# EAGLE board touch_board (EAGLE 6.6.0)
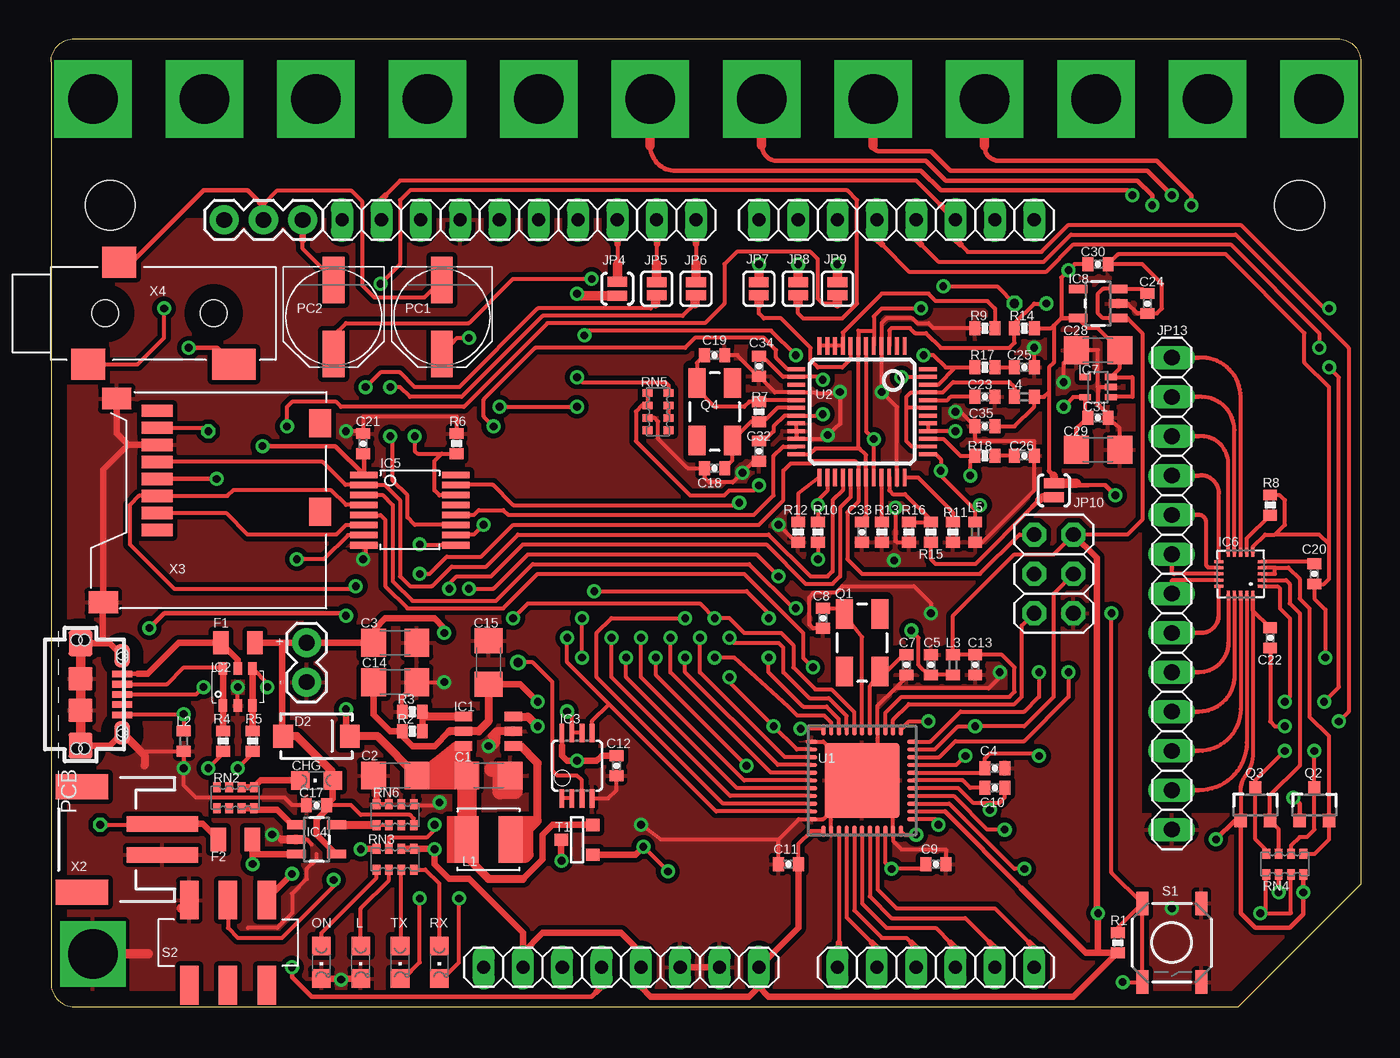
[diagram p2: board, top side]
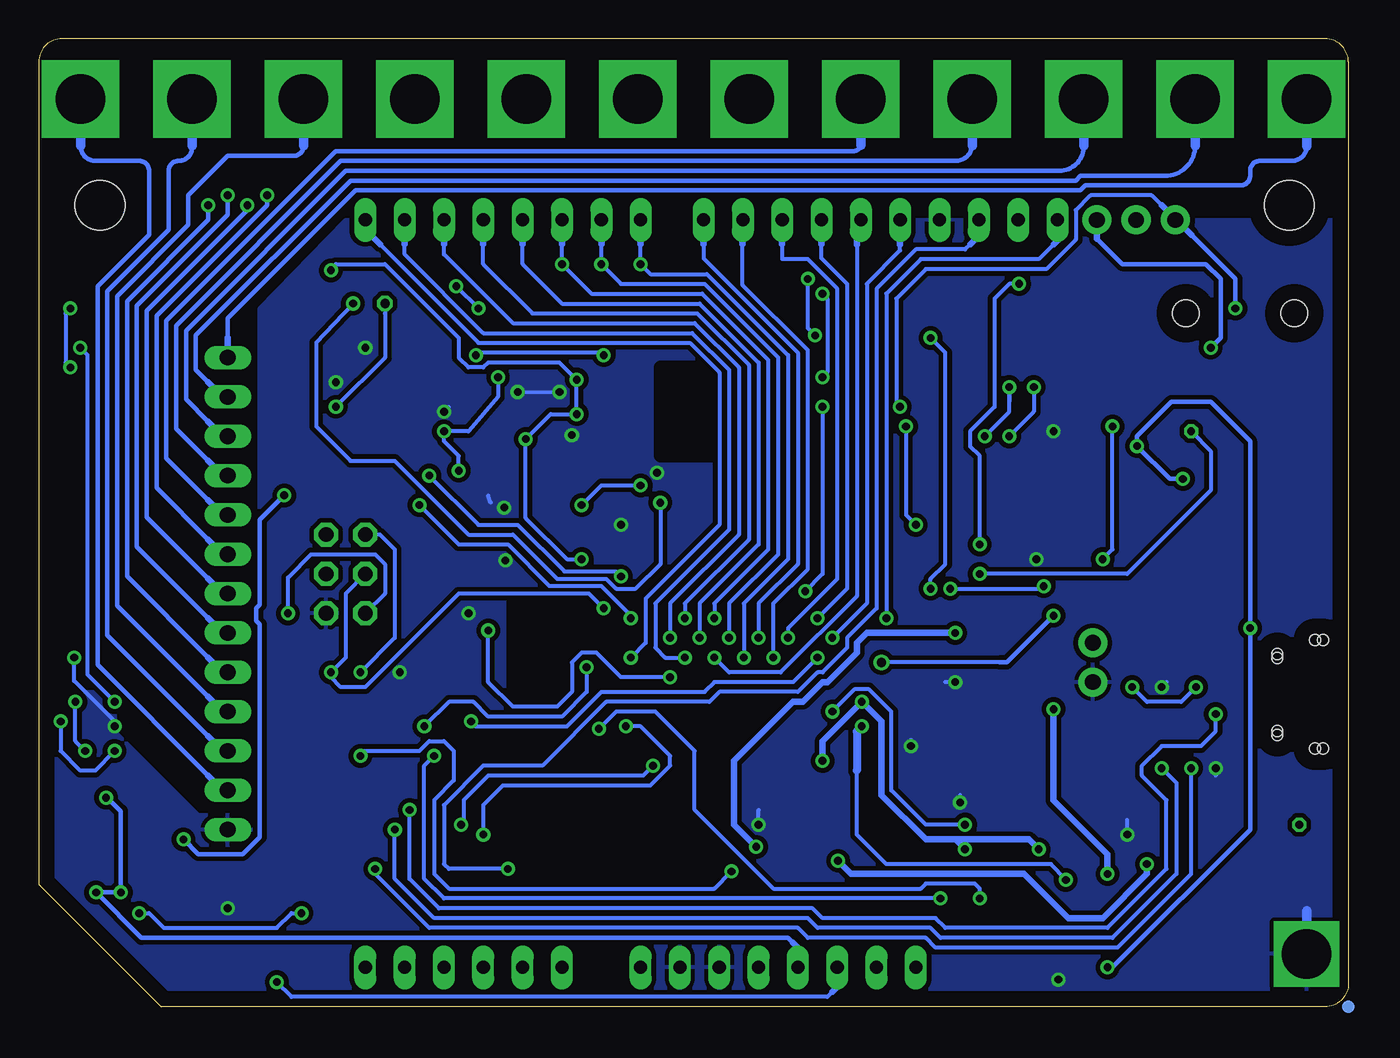
[diagram p3: board, bottom side, seen from below]

Size 84.6 x 62.5 mm. Coordinates in mm from the lower left corner, seen from the top.
Outline: 0,61 0,1.5 arc90 1.5,0 76.7,0 84.6,7.9 84.6,61 arc90 83.1,62.5 1.5,62.5 arc90 0,61
Copper layers (1*16): Top 0.035mm / dielectric 1.5mm / Bottom 0.035mm
Design rules "default *": minimum track width 10mil, minimum drill 20mil, track to track 8mil, track to pad 8mil, pad to pad 8mil, via to via 8mil, smd to smd 8mil, copper to edge 40mil, drill to drill 8mil, minimum pad ring 10mil, minimum via ring 8mil, stop-mask expansion 1.25mil, vias tented up to drill 0mil, thermal gap 10mil
Net classes: 1 power: width 0.254 mm, drill 0.61 mm, clearance 0.254 mm; 2 gnd: width 0.254 mm, drill 0.61 mm, clearance 0.254 mm; 3 usbvcc: width 0.254 mm, drill 0.61 mm, clearance 0.254 mm; 4 aref: width 0.254 mm, drill 0.61 mm, clearance 0.254 mm
Holes 3.2 mm at 80.64,51.75 3.81,51.75
tRestrict: area 41.3,35.6 to 44.5,41.3; area 50.8,20.6 to 54,26.4; area 27.6,9.4 to 28.9,12.2
bRestrict: area 41.3,35.6 to 44.5,41.3; area 50.8,20.6 to 54,26.4

## Footprints (pad centres in the part's own frame; a part is rotated, then mirrored left to right if it is on the bottom)
1206 = smd 1.6 x 1.8: 1 -1.4,0; 2 1.4,0
0402-CAP = smd 0.7 x 0.9: 1 -0.65,0; 2 0.65,0
CHIPLED_0805 = smd 1.2 x 1.2: A 0,-1.05; C 0,1.05
SMA-DIODE = smd 1.27 x 1.47: A -2.15,0; C 2.15,0
0805 = smd 1 x 1.5: 1 -1.1,0; 2 1.1,0
6-LEAD-SOT23 = smd 0.6 x 1.1: 1 -0.95,-1.6; 2 0,-1.6; 3 0.95,-1.6; 4 0.95,1.6; 5 0,1.6; 6 -0.95,1.6
SOT457 = smd 0.8 x 0.55: 1 -1.2,0.95; 2 -1.2,0; 3 -1.2,-0.95; 4 1.2,-0.95; 5 1.2,0; 6 1.2,0.95
MSOP08 = smd 0.3 x 1.2: 1 -0.976,-2.113; 2 -0.326,-2.113; 3 0.324,-2.113; 4 0.974,-2.113; 5 0.974,2.112; 6 0.324,2.112; 7 -0.326,2.112; 8 -0.976,2.112
SOT23-5 = smd 0.55 x 1.2: 1 -0.95,-1.3; 2 0,-1.3; 3 0.95,-1.3; 4 0.95,1.3; 5 -0.95,1.3
TSSOP-16 = smd 0.42 x 1.78: 1 -2.275,-2.97; 2 -1.625,-2.97; 3 -0.975,-2.97; 4 -0.325,-2.97; 5 0.325,-2.97; 6 0.975,-2.97; 7 1.625,-2.97; 8 2.275,-2.97; 9 2.275,2.97; 10 1.625,2.97; 11 0.975,2.97; 12 0.325,2.97; 13 -0.325,2.97; 14 -0.975,2.97; 15 -1.625,2.97; 16 -2.275,2.97
QFN-20-0.4MM = smd 0.6 x 0.2: 1 -1.4,0.8; 2 -1.4,0.4; 3 -1.4,0; 4 -1.4,-0.4; 5 -1.4,-0.8; 11 1.4,-0.8; 12 1.4,-0.4; 13 1.4,0; 14 1.4,0.4; 15 1.4,0.8 | smd 0.2 x 0.6: 6 -0.8,-1.4; 7 -0.4,-1.4; 8 0,-1.4; 9 0.4,-1.4; 10 0.8,-1.4; 16 0.8,1.4; 17 0.4,1.4; 18 0,1.4; 19 -0.4,1.4; 20 -0.8,1.4
SC70 = smd 0.4 x 0.75: 1 -0.65,-0.825; 2 0,-0.825; 3 0.65,-0.825; 4 0.65,0.825; 5 -0.65,0.825
2X03 = drill 0.95 pad 1.55 octagon: 1 -2.54,-1.27; 2 -2.54,1.27; 3 0,-1.27; 4 0,1.27; 5 2.54,-1.27; 6 2.54,1.27
1X08 = drill 0.85 pad 1.422 long: 1 -8.89,0; 2 -6.35,0; 3 -3.81,0; 4 -1.27,0; 5 1.27,0; 6 3.81,0; 7 6.35,0; 8 8.89,0
1X06 = drill 0.85 pad 1.422 long: 1 -6.35,0; 2 -3.81,0; 3 -1.27,0; 4 1.27,0; 5 3.81,0; 6 6.35,0
1X02 = drill 1.016 pad 1.88: 1 0,0; 2 2.54,0
1X10 = drill 0.85 pad 1.422 long: 1 -11.43,0; 2 -8.89,0; 3 -6.35,0; 4 -3.81,0; 5 -1.27,0; 6 1.27,0; 7 3.81,0; 8 6.35,0; 9 8.89,0; 10 11.43,0
SJ_2S-NO = smd 0.635 x 1.27: 1 -0.45,0; 2 0.45,0
SJ_2S = smd 0.635 x 1.27: 1 -0.412,0; 2 0.412,0
1X03 = drill 1.016 pad 1.88: 1 0,0; 2 2.54,0; 3 5.08,0
1X13 = drill 1.016 long: 1 -15.24,0; 2 -12.7,0; 3 -10.16,0; 4 -7.62,0; 5 -5.08,0; 6 -2.54,0; 7 0,0; 8 2.54,0; 9 5.08,0; 10 7.62,0; 11 10.16,0; 12 12.7,0; 13 15.24,0
LQH44PN100MP0L = smd 1.55 x 3: 1 -1.425,0; 2 1.425,0
0402 = smd 0.7 x 0.9: 1 -0.65,0; 2 0.65,0
TP-SP = smd 0.8 x 0.8 bottom: X 0,0
PANASONIC_D = smd 3 x 1.4: + 2.4,0; - -2.4,0
CRYSTAL-SMD-5X3 = smd 1.9 x 1.1: 1 -1.85,-1.15; 2 1.85,-1.15; 3 1.85,1.15; 4 -1.85,1.15
SOT23-3 = smd 0.8 x 0.9: 1 -0.95,-1; 2 0.95,-1; 3 0,1.1
0402-RES = smd 0.7 x 0.9: 1 -0.65,0; 2 0.65,0
CAY16 = smd 0.5 x 0.65: 1 -1.2,-0.675; 2 -0.4,-0.675; 3 0.4,-0.675; 4 1.2,-0.675; 5 1.2,0.675; 6 0.4,0.675; 7 -0.4,0.675; 8 -1.2,0.675
TACTILE_SWITCH_SMD@1 = smd 1.524 x 0.762: 1 -2.54,1.905; 2 2.54,1.905; 3 -2.54,-1.905; 4 2.54,-1.905
JS202011SCQN = smd 1.2 x 2.5: 1 -2.5,-2.75; 2 0,-2.75; 3 2.5,-2.75; 4 -2.5,2.75; 5 0,2.75; 6 2.5,2.75
SOT-23 = smd 0.787 x 0.889: 1 0.025,-1.016; 2 -0.94,1.016; 3 0.991,1.016
QFN44ML7X7 = smd 0.75 x 0.275: 1 -3.275,2.5; 2 -3.275,2; 3 -3.275,1.5; 4 -3.275,1; 5 -3.275,0.5; 6 -3.275,0; 7 -3.275,-0.5; 8 -3.275,-1; 9 -3.275,-1.5; 10 -3.275,-2; 11 -3.275,-2.5; 23 3.275,-2.5; 24 3.275,-2; 25 3.275,-1.5; 26 3.275,-1; 27 3.275,-0.5; 28 3.275,0; 29 3.275,0.5; 30 3.275,1; 31 3.275,1.5; 32 3.275,2; 33 3.275,2.5 | smd 0.275 x 0.75: 12 -2.5,-3.275; 13 -2,-3.275; 14 -1.5,-3.275; 15 -1,-3.275; 16 -0.5,-3.275; 17 0,-3.275; 18 0.5,-3.275; 19 1,-3.275; 20 1.5,-3.275; 21 2,-3.275; 22 2.5,-3.275; 34 2.5,3.275; 35 2,3.275; 36 1.5,3.275; 37 1,3.275; 38 0.5,3.275; 39 0,3.275; 40 -0.5,3.275; 41 -1,3.275; 42 -1.5,3.275; 43 -2,3.275; 44 -2.5,3.275 | smd 4.826 x 4.826: EXP 0,0
LQFP-48 = smd 0.254 x 1.143: 1 -2.75,-4.25; 2 -2.25,-4.25; 3 -1.75,-4.25; 4 -1.25,-4.25; 5 -0.75,-4.25; 6 -0.25,-4.25; 7 0.25,-4.25; 8 0.75,-4.25; 9 1.25,-4.25; 10 1.75,-4.25; 11 2.25,-4.25; 12 2.75,-4.25; 25 2.75,4.25; 26 2.25,4.25; 27 1.75,4.25; 28 1.25,4.25; 29 0.75,4.25; 30 0.25,4.25; 31 -0.25,4.25; 32 -0.75,4.25; 33 -1.25,4.25; 34 -1.75,4.25; 35 -2.25,4.25; 36 -2.75,4.25 | smd 1.143 x 0.254: 13 4.25,-2.75; 14 4.25,-2.25; 15 4.25,-1.75; 16 4.25,-1.25; 17 4.25,-0.75; 18 4.25,-0.25; 19 4.25,0.25; 20 4.25,0.75; 21 4.25,1.25; 22 4.25,1.75; 23 4.25,2.25; 24 4.25,2.75; 37 -4.25,2.75; 38 -4.25,2.25; 39 -4.25,1.75; 40 -4.25,1.25; 41 -4.25,0.75; 42 -4.25,0.25; 43 -4.25,-0.25; 44 -4.25,-0.75; 45 -4.25,-1.25; 46 -4.25,-1.75; 47 -4.25,-2.25; 48 -4.25,-2.75
EDGE-ELEC-LEFT = drill 3.2 pad 5 square: 1 0,0
EDGE-ELEC-RIGHT = drill 3.2 pad 5 square: 1 0,0
EDGE-GND = drill 3.2 pad 4 square: P$1 0,0
EDGE-ELEC = drill 3.2 pad 5 square: 1 0,0
CON2_USB_MICRO_B_AT = smd 0.406 x 1.346: P1 -1.321,2.692; P2 -0.66,2.692; P3 0,2.692; P4 0.66,2.692; P5 1.321,2.692 | smd 1.651 x 1.549: S1 -3.302,0; S2 3.302,0 | smd 1.524 x 1.016: S3 -2.489,2.692; S4 2.489,2.692 | smd 1.524 x 1.524: S5 -1.016,0; S6 1.016,0 | hole 0.7: -3.505,0.254; -3.505,-0.254; 3.505,0.254; 3.505,-0.254; -2.616,2.692; -2.362,2.692; 2.362,2.692; 2.616,2.692
JST-2-SMD = smd 1 x 4.6: 1 -1,-3.7; 2 1,-3.7 | smd 1.6 x 3.4: NC1 -3.4,1.5; NC2 3.4,1.5
MSDC-PP-02 = smd 0.8 x 2: 1 5.06,10.94; 2 6.16,10.94; 3 7.26,10.94; 4 8.36,10.94; 5 9.46,10.94; 6 10.56,10.94; 7 11.66,10.94; 8 12.76,10.94 | smd 1.8 x 1.4: CD1 6.25,0.4; CD2 11.95,0.4 | smd 1.4 x 1.9: S1 0.4,14.4; S2 13.55,13.54
3POLE-JACK = smd 2.2 x 2: 1 2.4,-3.3; 3 4.4,3.3 | smd 2.8 x 2: 2 11.8,-3.3 | hole 1.7: 3.5,0; 10.5,0

## Placement (x,y rotation side)
C1  10uF  [1206]  28.26,14.92 0 top
C2  10uF  [1206]  22.23,14.92 180 top
C3  10uF  [1206]  22.23,23.5 0 top
C4  0.1uF  [0402-CAP]  60.96,15.4 180 top
C5  1uF  [0402-CAP]  56.83,22.07 270 top
C7  22pF  [0402-CAP]  55.24,22.07 270 top
C8  22pF  [0402-CAP]  49.85,25.08 270 top
C9  0.1uF  [0402-CAP]  57.15,9.21 180 top
C10  1uF  [0402-CAP]  60.96,14.13 180 top
C11  0.1uF  [0402-CAP]  47.62,9.21 0 top
C12  0.1uF  [0402-CAP]  36.51,15.56 90 top
C13  0.1uF  [0402-CAP]  59.69,22.07 90 top
C14  10uF  [1206]  22.23,20.95 0 top
C15  10uF  [1206]  28.26,22.23 90 top
C17  1uF  [0402-CAP]  17.14,13.02 0 top
C18  22pF  [0402-CAP]  42.86,34.77 180 top
C19  22pF  [0402-CAP]  42.86,42.07 0 top
C20  0.1uF  [0402-CAP]  81.6,27.94 90 top
C21  0.1uF  [0402-CAP]  20.16,36.35 270 top
C22  0.1uF  [0402-CAP]  78.74,23.81 90 top
C23  1uF  [0402-CAP]  60.33,39.37 0 top
C24  1uF  [0402-CAP]  70.8,45.4 90 top
C25  0.01uF  [0402-CAP]  62.87,41.27 180 top
C26  0.01uF  [0402-CAP]  62.87,35.56 180 top
C28  10uF  [1206]  67.63,42.39 180 top
C29  10uF  [1206]  67.63,35.96 0 top
C30  0.1uF  [0402-CAP]  67.63,47.94 180 top
C31  0.1uF  [0402-CAP]  67.63,38.02 180 top
C32  0.1uF  [0402-CAP]  45.72,35.88 90 top
C33  0.1uF  [0402-CAP]  52.39,30.64 90 top
C34  0.1uF  [0402-CAP]  45.72,41.35 90 top
C35  0.1uF  [0402-CAP]  60.33,37.47 0 top
CHG  Yellow  [CHIPLED_0805]  17.14,14.61 90 top
D2  B340  [SMA-DIODE]  17.14,17.46 0 top
F1  500mA  [0805]  12.06,23.5 0 top
F2  1.1A  [0805]  11.91,10.79 0 top
IC1  MCP1640  [6-LEAD-SOT23]  28.26,17.78 90 top
IC2  ESD Diode  [SOT457]  12.06,20.64 90 top
IC3  LM358  [MSOP08]  33.97,15.56 0 top
IC4  MCP73831  [SOT23-5]  17.14,10.79 270 top
IC5  74HC4050  [TSSOP-16]  23.18,32.07 270 top
IC6  MPR121  [QFN-20-0.4MM]  76.83,27.94 180 top
IC7  1.8V  [SC70]  67.63,40.01 90 top
IC8  MIC5219  [SOT23-5]  67.63,45.4 90 top
ICSP  ICSP  [2X03]  64.77,27.94 270 top
J1  8x1F-H8.5  [1X08]  36.83,2.54 0 top
J2  6x1F-H8.5  [1X06]  57.15,2.54 0 top
J3  8x1F-H8.5  [1X08]  54.61,50.8 180 top
JP1  External  [1X02]  16.51,20.95 90 top
JP3  10x1F-H8.5  [1X10]  30.23,50.8 180 top
JP4  [SJ_2S-NO]  36.58,46.35 90 top
JP5  [SJ_2S]  39.12,46.35 90 top
JP6  [SJ_2S]  41.66,46.35 90 top
JP7  [SJ_2S]  45.72,46.35 90 top
JP8  [SJ_2S]  48.26,46.35 90 top
JP9  [SJ_2S]  50.8,46.35 90 top
JP10  [SJ_2S-NO]  64.77,33.34 90 top
JP11  External Speaker  [1X03]  11.18,50.8 0 top
JP13  Touch Electrodes  [1X13]  72.39,26.67 270 top
L  Red  [CHIPLED_0805]  20,2.86 180 top
L1  LQH44P  [LQH44PN100MP0L]  28.26,10.79 180 top
L2  Ferrite  [0402]  8.57,17.14 90 top
L3  [0402]  58.26,22.07 270 top
L4  Ferrite  [0402]  62.87,39.37 180 top
L5  Ferrite  [0402]  59.69,30.64 270 top
ON  Green  [CHIPLED_0805]  17.46,2.86 180 top
ORIGIN  TP_SP  [TP-SP]  0,0 0 top
PC1  220uF  [PANASONIC_D]  25.24,44.53 270 top
PC2  220uF  [PANASONIC_D]  18.26,44.53 270 top
Q1  16MHz  [CRYSTAL-SMD-5X3]  52.39,23.5 270 top
Q2  BSS138  [SOT23-3]  81.6,13.02 0 top
Q3  BSS138  [SOT23-3]  77.79,13.02 0 top
Q4  12.288MHz  [CRYSTAL-SMD-5X3]  42.86,38.42 270 top
R1  75k  [0402-RES]  68.9,4.13 90 top
R2  976K  [0402-RES]  23.34,17.78 180 top
R3  309K  [0402-RES]  23.34,19.05 180 top
R4  22R  [0402-RES]  11.11,17.14 270 top
R5  22R  [0402-RES]  13.02,17.14 270 top
R6  75k  [0402-RES]  26.19,36.35 90 top
R7  976k  [0402-RES]  45.72,38.42 90 top
R8  75k  [0402-RES]  78.74,32.38 90 top
R9  75k  [0402-RES]  60.33,43.81 180 top
R10  75k  [0402-RES]  48.26,30.64 270 top
R11  75k  [0402-RES]  58.26,30.64 270 top
R12  75k  [0402-RES]  49.53,30.64 90 top
R13  75k  [0402-RES]  53.66,30.64 270 top
R14  75k  [0402-RES]  62.87,43.81 180 top
R15  75k  [0402-RES]  55.4,30.64 270 top
R16  75k  [0402-RES]  56.83,30.64 90 top
R17  22R  [0402-RES]  60.33,41.27 0 top
R18  22R  [0402-RES]  60.33,35.56 0 top
RN2  1K  [CAY16]  11.91,13.49 180 top
RN3  1K  [CAY16]  22.23,9.53 180 top
RN4  1K  [CAY16]  79.69,9.21 180 top
RN5  10k  [CAY16]  39.21,38.42 270 top
RN6  10K  [CAY16]  22.23,12.38 0 top
RX  Yellow  [CHIPLED_0805]  25.08,2.86 180 top
S1  RESET  [TACTILE_SWITCH_SMD@1]  72.39,4.13 270 top
S2  DPDT  [JS202011SCQN]  11.43,4.13 0 top
T1  FDN340P  [SOT-23]  33.97,10.79 270 top
TX  Yellow  [CHIPLED_0805]  22.54,2.86 180 top
U1  ATMEGA32U4  [QFN44ML7X7]  52.39,14.61 180 top
U2  VS1053  [LQFP-48]  52.39,38.42 180 top
U$1  EDGE-ELEC-LEFT  [EDGE-ELEC-LEFT]  2.7,58.6 0 top
U$3  EDGE-ELEC-RIGHT  [EDGE-ELEC-RIGHT]  81.9,58.6 0 top
U$6  EDGE-GND  [EDGE-GND]  2.7,3.4 0 top
U$8  OSHW-LOGO  [OSHW-LOGO]  -3.02,-1.43 0 top  (outside the outline)
U$17  EDGE-ELEC  [EDGE-ELEC]  74.7,58.6 0 top
U$18  EDGE-ELEC  [EDGE-ELEC]  67.5,58.6 0 top
U$22  EDGE-ELEC  [EDGE-ELEC]  60.3,58.6 0 top
U$24  EDGE-ELEC  [EDGE-ELEC]  53.1,58.6 0 top
U$26  EDGE-ELEC  [EDGE-ELEC]  45.9,58.6 0 top
U$27  EDGE-ELEC  [EDGE-ELEC]  38.7,58.6 0 top
U$28  EDGE-ELEC  [EDGE-ELEC]  31.5,58.6 0 top
U$29  EDGE-ELEC  [EDGE-ELEC]  24.3,58.6 0 top
U$30  EDGE-ELEC  [EDGE-ELEC]  17.1,58.6 0 top
U$31  EDGE-ELEC  [EDGE-ELEC]  9.9,58.6 0 top
X1  USB MICRO  [CON2_USB_MICRO_B_AT]  1.91,20.16 270 top
X2  Batt  [JST-2-SMD]  3.49,10.79 90 top
X3  MICRO-SD  [MSDC-PP-02]  17.78,25.72 90 top
X4  [3POLE-JACK]  0,44.77 0 top

## Tracks (layer width: path | path; a pad name or v marks a point on that pad's centre or on a via)
1.8V  (via drill 0.5, 0.6)
  Top 0.254: C29.1 66.23,37.35 C31.2 66.8,38.27 IC7.5 66.03,39.35 v65.41,38.73 | U2.24 49,35.67 49.37,36.04 52.23,36.04 | C33.2 52.39,31.43 52.64,31.68 U2.31 52.64,35.63 52.23,36.04 | v56.2,45.09 53.66,45.09 53.14,44.56 U2.5 53.14,43.66 52.14,43.66 U2.7 52.14,36.13 52.23,36.04 | v57.63,46.51 61.12,46.51 v62.23,45.4
  Bottom 0.254: v57.63,46.51 v56.2,45.09 | v65.41,38.73 62.23,41.91 62.23,44.77 v62.23,45.4
3.3V  (via drill 0.5, 0.6)
  Top 0.254: RN4.8 80.96,8.46 | Q3.1 76.83,12.33 | 76.83,12.34 Q3.1 | C22.2 77.64,25.57 IC6.20 77.64,16.36 arc-37 77.15,14.92 arc42 76.83,13.81 76.83,12.34 | U2.6 52.64,37.15 v53.14,36.65 U2.32 | IC7.1 68.47,39.37 69.85,39.37 69.85,40.64 69.83,40.66 IC7.3 69.03,41.23 C28.1 69.03,42.41 67.63,43.81 66.97,43.81 IC8.5 | v49.85,38.26 49.85,38.17 U2.19 47.38,38.17 46.67,37.47 46.67,37.15 46.05,36.53 C32.2 | v49.85,40.48 49.85,40.67 U2.14 47.28,40.67 45.95,42 C34.2 | R12.1 v49.53,28.89 | 76.83,12.34 76.83,12.33 | 20.21,35.66 C21.2 | 65.25,44.45 | 65.25,44.45 IC8.5 | IC8.5 65.25,44.45 | 65.25,44.45 | JP10.2 64.9,33.66 | 64.77,43.97 65.25,44.45 | 65.25,44.45 65.25,47.07 v65.72,47.55 66.12,47.94 C30.2 | 64.77,43.97 64.77,41.59 64.45,41.27 64.45,39.69 | C35.2 62.23,37.47 63.52,38.75 L4.1 64.14,39.37 64.45,39.69 | 76.83,12.33 Q3.1 | R14.1 64.61,43.81 64.77,43.97 | 64.45,39.69 64.45,34.61 | 34.29,14.61 IC3.3 34.3,14.6 34.29,14.61 | 34.29,14.61 33.97,14.92 32.7,14.92 32.38,15.24 32.38,20.95 31.11,22.23 v30.16,22.23 | 68.1,33.66 66.99,33.66
  Top 0.305: X3.4 v10.69,34.08 | RN4.8 v80.89,7.37 80.89,5.96 80.01,5.08 77.79,5.08 76.83,6.03 Q3.1 | 20.21,35.66 IC5.1 18.36,36.2 v13.65,36.2 | Q2.1 80.65,13.09 v80.25,13.49 | Q3.1 76.47,12.02 v75.25,10.79 | 68.1,33.66 v68.74,33.02 | 35.56,1.27 34.92,0.64 16.83,0.64 15.56,1.91 v15.56,2.54 | RN4.6 v79.29,7.37 | 64.77,34.29 64.45,34.61 | 66.22,33.79 66.36,33.66 66.99,33.66 | v6.35,24.45 7.3,25.4 18.89,25.4 v19.05,25.24
  Top 0.406: 35.24,0.95 35.56,1.27 J1.4
  Top 0.508: 64.77,34.29 JP10.2
  Top 0.61: 66.22,33.79 JP10.2
  Bottom 0.254: v49.53,28.89 50.48,28.89 53.14,31.55 v53.14,36.65 51.53,38.26 v49.85,38.26 v49.85,40.48 50.96,41.59 55.56,41.59 55.88,41.27 56.83,41.27 57.47,41.91 57.47,43.18 62.23,47.94 65.41,47.94 65.72,47.62 v65.72,47.55 | 80.17,13.49 v80.25,13.49 | 22.54,22.23 v30.16,22.23
  Bottom 0.305: 35.88,4.13 36.2,4.45 77.97,4.45 v80.89,7.37 v79.29,7.37 79.29,12.62 80.17,13.49 | v10.69,34.08 11.54,34.08 v13.65,36.2 13.65,36.83 11.43,39.05 8.89,39.05 6.35,36.51 v6.35,24.45 6.35,11.43 15.24,2.54 v15.56,2.54 | v75.25,10.79 74.3,9.84 71.44,9.84 70.33,10.95 70.33,24.69 70.56,24.92 70.56,25.72 70.33,25.96 70.33,31.43 v68.74,33.02 | v19.05,25.24 22.07,22.23 22.54,22.23
  Bottom 0.406: 35.88,4.13 35.56,3.81 J1.4
5V  (via drill 0.5)
  Top 0.254: L3.1 58.1,22.54 | L3.1 58.26,25.24 62.23,29.21 64.77,29.21 ICSP.2 69.53,30.48 70.48,31.43 70.48,43.5 69.53,44.45 IC8.1 67.94,44.45 67.63,44.77 67.63,46.04 67.94,46.35 IC8.3 70.5,46.35 C24.2 | C13.2 L3.1 | 78.42,8.46 78.42,8.53 RN4.5 | RN4.5 arc90 78.42,8.46 | RN4.5 arc90 78.42,8.46 | 78.42,8.46 78.42,6.03 | 78.42,6.03 80.09,6.03 RN4.7 | 68.88,3.49 R1.1 | U1.34 49.11,11.33 48.26,10.48 48.26,9.86 C11.2 | U1.2 57.72,12.61 | U1.14 53.89,18.96 54.93,20 61.91,20 62.23,20.32 62.23,21.91 61.42,22.72 C13.2 | 59.7,22.54 C13.2 | 78.42,6.03 v78.11,6.03
  Top 0.305: 57.72,12.61 62.71,7.62 | IC3.8 33,16.85
  Top 0.406: 30.48,3.49 31.75,4.76 36.83,4.76 38.1,3.49 J1.5 38.1,1.27 38.73,0.64 45.09,0.64 45.72,1.27 | 45.72,1.27 J1.8 48.27,5.09 C11.2 | 68.88,3.49 68.88,3.48 66.04,0.64 46.35,0.64 45.72,1.27 | 30.48,3.49 30.48,4.76 26.99,8.26 25.72,8.26 24.77,9.21 v24.77,10.16 24.73,10.2 RN3.1 RN3.2 | 30.48,3.49 J1.2 | R1.1 67.63,3.48 | 67.63,3.48 66.85,3.48 62.71,7.62 | ICSP.2 67.55,28.97 67.55,6.11 v67.63,6.03 67.63,3.48 | 20.64,20.77 C14.1 20.82,18.86 21.91,17.78 R2.2 22.69,17.48 23.34,16.83 24.77,16.83 25.72,17.78 | C12.2 35.58,16.21 35.24,15.88 v33.97,15.88 33.34,15.88 33,16.22 33,16.85 | C15.1 30.29,20.82 v31.43,19.68 | RN3.4 20.04,10.2 v20,10.16
  Top 0.508: 25.72,17.78 IC1.5 27.62,17.78 28.26,18.41 C15.1
  Bottom 0.254: v78.11,6.03 77.47,6.03 76.52,5.08 69.22,5.08 68.26,6.03 v67.63,6.03
  Bottom 0.406: v33.97,15.88 33.97,17.14 v31.43,19.68 30.16,18.41 30.16,13.65 27.3,10.79 25.4,10.79 | v20,10.16 20.64,10.79 25.4,10.79 | 25.4,10.79 v24.77,10.16
A0
  Top 0.254: U1.36 50.89,4.14
  Top 0.406: 50.89,4.14 50.89,2.63 J2.1
A1
  Top 0.254: U1.37 51.39,5.76 53.02,4.13
  Top 0.406: 53.02,4.13 53.34,3.81 J2.2
A2
  Top 0.254: U1.38 51.89,6.21 53.66,4.45 55.24,4.45 55.56,4.13
  Top 0.406: 55.56,4.13 55.88,3.81 J2.3
A3
  Top 0.254: U1.39 52.39,6.67 53.98,5.08 57.15,5.08 58.1,4.13
  Top 0.406: 58.1,4.13 58.42,3.81 J2.4
A4
  Top 0.254: U1.40 52.89,7.12 54.29,5.71 59.05,5.71 60.64,4.13
  Top 0.406: 60.64,4.13 60.96,3.81 J2.5
A5
  Top 0.254: U1.41 53.39,7.57 54.61,6.35 60.96,6.35 63.18,4.13
  Top 0.406: 63.18,4.13 63.5,3.81 J2.6
AGND  (via drill 0.5)
  Top 0.254: U2.37 57.15,35.67 57.47,35.35 v57.47,34.61 57.47,34.29 59.69,32.07 | v54.93,40.64 54.93,40.67 U2.47 | v28.97,38.73 v33.97,38.73 | v46.35,25.08 46.35,25.4 44.93,26.83 v35.08,26.83 | v58.42,37.15 58.42,37.17 U2.40 U2.41 | L5.1 59.69,32.07 | X4.1 5.59,41.47 7.3,43.18 v7.3,45.09 | v60.01,32.38 59.69,32.07
  Bottom 0.254: v54.93,40.64 54.93,39.37 56.83,37.15 v58.42,37.15 58.42,36.51 57.47,35.56 v57.47,34.61 | v33.97,38.73 33.97,27.94 v35.08,26.83 | v46.35,25.08 46.35,25.24 48.26,27.15 51.59,27.15 54.29,29.84 57.47,29.84 v60.01,32.38 | v28.97,38.73 29.21,38.97 29.21,45.72 27.3,47.62 19.53,47.62 17.62,49.53 17.62,51.44 16.67,52.39 12.7,52.39 12.06,51.75
  Bottom 0.305: v7.3,45.09 7.3,46.99 10.16,49.85
  Bottom 0.406: 12.06,51.75 11.18,50.86 JP11.1 11.11,50.8 10.16,49.85
AREF  (via drill 0.5)
  Top 0.254: U1.42 53.89,9.29 v54.29,8.89 56.18,8.89 C9.2
  Bottom 0.254: 24.43,49.23 24.77,48.9 27.94,48.9 30.48,46.35 30.48,25.72 32.38,23.81 32.38,23.18 33.97,21.59 34.29,21.59 35.56,20.32 40.64,20.32 41.27,19.68 47.94,19.68 52.07,15.56 55.88,15.56 58.42,13.02 58.42,9.21 58.1,8.89 v54.29,8.89
  Bottom 0.406: JP3.8 23.88,49.78 24.43,49.23
AVCC  (via drill 0.5)
  Top 0.254: U1.24 48.16,16.61 v46.67,18.1 43.81,20.95 v43.81,21.27 | L3.2 C5.2 56.67,21.42 56.04,22.05 56.04,23.81 v55.56,24.29 | U1.44 55.1,11.11 v55.88,11.11
  Bottom 0.254: v46.67,18.1 45.72,18.1 43.81,16.19 43.81,15.56 45.09,14.29 54.61,14.29 55.88,13.02 v55.88,11.11 | v55.56,24.29 55.56,20.95 53.98,19.37 51.12,19.37 50.16,20.32 50.16,22.23 49.53,22.86 48.58,22.86 46.99,21.27 v43.81,21.27
AVDD
  Top 0.254: U2.38 55.59,36.17 55.24,36.51 55.24,38.67 | U2.43 55.24,38.67 | 55.24,38.67 55.24,39.37 55.54,39.67 U2.45 57.61,39.67 58.26,40.32 61.91,40.32 62.22,40.02 L4.2 62.23,39.7
D0/RX  (via drill 0.5)
  Top 0.254: v46.35,22.54 46.35,21.59 48.58,19.37 50.09,19.37 50.89,18.57 U1.20
  Bottom 0.254: v46.35,22.54 45.4,23.5 45.4,26.35 40.64,31.11 40.64,40.96 42.55,42.86 56.2,42.86 62.55,49.21
  Bottom 0.406: 62.55,49.21 63.5,50.16 J3.1
D1/TX  (via drill 0.5)
  Top 0.254: v42.86,22.54 44.13,22.54 47.62,19.37 48.18,18.81 49.93,18.81 50.39,18.35 U1.21
  Bottom 0.254: v42.86,22.54 44.13,22.54 44.77,23.18 44.77,26.04 40.01,30.8 40.01,41.12 42.39,43.5 55.88,43.5 60.96,48.58 60.96,49.21
  Bottom 0.406: 60.96,49.21 J3.2
D2/SDA  (via drill 0.5)
  Top 0.254: 21.57,52.37 22.54,53.34 55.88,53.34 57.47,51.75 | U1.19 51.39,18.78 50.24,19.92 48.97,19.92 47.31,21.59 47.31,23.18 46.99,23.5 44.13,23.5 v43.81,23.81 | 81.6,13.97 v81.6,16.51 Q2.3 81.6,11.43 81.12,10.95 80.64,10.95 80.09,10.4 RN4.2 | 82.55,19.68 v82.23,19.68 83.19,20.64 83.19,40.64 v82.55,41.27 82.87,40.96 | v82.55,45.09 82.23,45.09 76.83,50.48 65.72,50.48 63.98,48.74 59.21,48.74 58.74,49.21
  Top 0.406: 21.57,52.37 21.34,52.13 JP3.9 | 58.74,49.21 58.42,49.53 J3.3 57.47,51.75
  Bottom 0.254: v82.23,19.68 82.23,17.14 v81.6,16.51 | v43.81,23.81 43.81,26.04 39.37,30.48 39.37,41.27 42.23,44.13 53.98,44.13 58.42,48.58 58.42,49.21 | v82.55,45.09 82.87,44.77 82.87,41.59 v82.55,41.27
  Bottom 0.406: 58.42,49.21 J3.3
D2/SDA_L
  Top 0.254: RN4.1 80.93,9.84 81.6,9.84 82.55,10.79 Q2.2 82.55,12.34 82.55,17.46 81.28,18.73 81.28,25.72 80.64,26.35 80.64,27.62 79.93,28.34 79.06,28.34 | 79.06,28.34 IC6.4 | IC6.3 79.06,27.94 79.06,28.34
D3/SCL  (via drill 0.5)
  Top 0.254: U1.18 51.89,18.99 50.4,20.48 49.37,20.48 47.94,21.91 47.94,23.34 47.15,24.13 44.77,24.13 43.81,25.08 v42.86,25.08 41.91,26.04 30.8,26.04 v29.84,25.08 | RN4.4 78.42,9.95 78.42,10.16 77.79,10.79 Q3.3 77.79,14.61 v79.69,16.51 | v83.19,18.41 83.82,19.05 83.82,42.55 76.52,49.85 65.88,49.85 64.14,48.1 57.31,48.1 56.2,49.21
  Top 0.406: 56.2,49.21 55.88,49.53 J3.4
  Bottom 0.254: 19.03,49.23 20,48.26 27.62,48.26 29.84,46.04 v29.84,25.08 | v42.86,25.08 42.86,26.04 38.73,30.16 38.73,41.43 42.07,44.77 52.7,44.77 55.88,47.94 55.88,49.21 | v83.19,18.41 83.19,16.51 81.92,15.24 80.96,15.24 v79.69,16.51
  Bottom 0.406: JP3.10 18.8,49.47 19.03,49.23 | 55.88,49.21 J3.4
D3/SCL_L
  Top 0.254: RN4.3 79.29,11.46 Q3.2 78.74,13.65 80.64,15.56 80.64,25.4 80.01,26.04 80.01,27.3 79.78,27.54 IC6.2
D4/IRQ  (via drill 0.5)
  Top 0.254: 48.35,16.11 U1.25 47.4,16.11 41.91,21.59 v41.91,23.81 | IC6.1 79.22,27.14 79.38,26.99 79.38,25.72 80.01,25.08 80.01,20 v79.69,19.68 | 53.66,49.21 55.4,47.47 64.29,47.47 66.04,49.21 76.2,49.21 81.92,43.5 v81.92,42.55
  Top 0.406: 53.66,49.21 53.34,49.53 J3.5
  Bottom 0.254: v81.92,42.55 81.44,42.07 81.44,21.43 v79.69,19.68 | v41.91,23.81 41.91,26.04 38.1,29.84 38.1,41.59 41.91,45.4 50.8,45.4 53.34,47.94 53.34,49.21
  Bottom 0.406: 53.34,49.21 J3.5
D5*/SD-CS  (via drill 0.5)
  Top 0.254: U1.31 43.41,13.11 35.24,21.27 35.24,24.13 36.2,25.08 v40.96,25.08
  Top 0.61: JP9.2 v50.8,47.94
  Bottom 0.254: v40.96,25.08 40.96,26.04 37.47,29.53 37.47,41.75 41.75,46.04 48.9,46.04 v50.8,47.94 50.8,49.21
  Bottom 0.406: 50.8,49.21 J3.6
D5*/SD-CS-*  (via drill 0.5)
  Top 0.254: 50.8,45.4 49.85,45.4 49.53,45.72 49.53,48.26 49.05,48.74 44.29,48.74 43.5,47.94 43.5,45.4 42.23,44.13 32.07,44.13 26.67,38.73 18.73,38.73 18.41,39.05 15.56,39.05 15.24,38.73 v15.24,37.47 | IC5.7 19.17,30.44 17.62,28.89 v15.88,28.89
  Top 0.61: JP9.1 50.8,45.4
  Bottom 0.254: v15.88,28.89 15.24,29.53 v15.24,37.47
D6*/MP3-DCS  (via drill 0.5)
  Top 0.254: U1.27 46.49,15.11 40.01,21.59 v40.01,23.81
  Top 0.61: JP8.2 v48.26,47.94
  Bottom 0.254: v40.01,23.81 40.01,26.04 36.83,29.21 36.83,41.91 41.59,46.67 46.99,46.67 v48.26,47.94 48.26,49.21
  Bottom 0.406: 48.26,49.21 J3.7
D6*/MP3-DCS-*  (via drill 0.5)
  Top 0.254: 48.26,45.4 48.26,44.77 48.58,44.45 51.12,44.45 52.07,45.4 52.07,52.07 51.44,52.7 23.18,52.7 22.54,52.07 22.54,47.94 22.23,47.62 21.91,47.31 v21.27,46.67 | IC5.9 23.86,29.79 v23.81,29.84
  Top 0.61: JP8.1 48.26,45.4
  Bottom 0.254: v23.81,29.84 23.81,35.56 24.45,36.2 24.45,37.15 22.86,38.73 22.86,45.72 21.91,46.67 v21.27,46.67
D7/MP3-DREQ  (via drill 0.5)
  Top 0.254: v39.05,22.54 39.05,21.43 v44.93,15.56 | v57.31,11.75 57.11,12.11 U1.1
  Top 0.61: JP7.2 v45.72,47.94
  Bottom 0.254: v39.05,22.54 39.05,26.04 36.2,28.89 36.2,42.07 41.43,47.31 45.09,47.31 v45.72,47.94 45.72,49.21 | v44.93,15.56 45.56,14.92 55.56,14.92 57.15,13.34 57.15,11.91 v57.31,11.75
  Bottom 0.406: 45.72,49.21 J3.8
D7/MP3-DREQ-*
  Top 0.254: U2.8 51.64,41.8 51.12,41.27 49.53,41.27 49.05,41.75 49.05,42.55 47.15,44.45 46.04,44.45 45.72,44.77 45.72,45.4
  Top 0.61: JP7.1 45.72,45.4
D+  (via drill 0.5)
  Top 0.254: X1.P3 9.37,20.16 v9.84,20.64 | IC2.4 13.97,20.88 v13.97,20.64
  Top 0.406: IC2.3 | R5.1 IC2.3 | IC2.3 IC2.4
  Bottom 0.254: v9.84,20.64 10.79,19.68 13.02,19.68 v13.97,20.64
D-
  Top 0.254: X1.P2 7.49,20.82 8.57,21.91 11.04,21.91 IC2.6
  Top 0.406: IC2.6 IC2.1 R4.1
ELE0
  Top 0.254: IC6.8 76.83,39.37 arc93 74.14,41.91
  Top 0.305: 74.14,41.91 JP13.1
  Bottom 0.305: 72.39,43.18 72.39,44.45 64.14,52.7 17.3,52.7 16.99,53.02 6.99,53.02 arc-90 6.35,53.66 6.35,53.98 arc90 5.71,54.61 3.65,54.61 arc-90 2.7,55.56
  Bottom 0.406: 72.39,43.18 JP13.1
  Bottom 0.61: U$1.1 2.7,55.56
ELE1
  Top 0.254: IC6.9 76.44,37.23 arc94 74.14,39.37
  Top 0.305: 74.14,39.37 JP13.2
  Bottom 0.305: 73.66,40.32 74.45,41.12 74.45,43.34 64.45,53.34 17.62,53.34 17.3,53.66 11.83,53.66 arc-90 9.9,55.58
  Bottom 0.406: 73.66,40.32 72.71,39.37 JP13.2
  Bottom 0.61: U$31.1 9.9,55.58
ELE2
  Top 0.254: IC6.10 76.03,35.09 arc95 74.14,36.83
  Top 0.305: 74.14,36.83 JP13.3
  Bottom 0.305: 73.66,37.78 75.09,39.21 75.09,43.66 64.77,53.98 18.66,53.98 arc-92 17.1,55.59
  Bottom 0.406: 73.66,37.78 72.71,36.83 JP13.3
  Bottom 0.61: U$30.1 17.1,55.59
ELE3
  Top 0.254: IC6.11 75.44,33.15 arc97 74.14,34.29
  Top 0.305: 74.14,34.29 JP13.4
  Bottom 0.305: 73.66,35.24 75.72,37.31 75.72,43.97 65.09,54.61 25.38,54.61 arc-84 24.3,55.59
  Bottom 0.406: 73.66,35.24 72.71,34.29 JP13.4
  Bottom 0.61: U$29.1 24.3,55.59
ELE4
  Top 0.254: IC6.12 74.85,28.34 arc-90 74.61,28.57 74.61,31.27 arc90 74.14,31.75
  Top 0.305: 74.14,31.75 JP13.5
  Bottom 0.305: 73.66,32.7 76.36,35.4 76.36,44.29 65.41,55.24 31.96,55.24 arc-76 31.5,55.61
  Bottom 0.406: 73.66,32.7 72.71,31.75 JP13.5
  Bottom 0.61: U$28.1 31.5,55.61
ELE5  (via drill 0.5)
  Top 0.254: IC6.13 72.55,27.94 arc-90 72.39,28.1 72.39,28.26
  Top 0.305: v69.85,52.39 69.53,52.7 57.47,52.7 56.2,53.98 40.32,53.98 arc-90 38.7,55.6 | JP13.6 72.39,28.26
  Top 0.61: U$27.1 38.7,55.6
  Bottom 0.305: v69.85,52.39 69.85,51.75 76.99,44.61 76.99,33.5 73.66,30.16
  Bottom 0.406: 73.66,30.16 72.71,29.21 JP13.6
ELE6  (via drill 0.5)
  Top 0.254: IC6.14 72.47,27.54 arc90 72.39,27.46
  Top 0.305: v71.12,51.75 71.12,52.39 70.17,53.34 57.78,53.34 56.52,54.61 46.91,54.61 arc-90 45.9,55.62 | 72.39,27.46 JP13.7
  Top 0.61: U$26.1 45.9,55.62
  Bottom 0.305: v71.12,51.75 71.12,51.44 77.63,44.93 77.63,31.59 73.66,27.62
  Bottom 0.406: 73.66,27.62 72.71,26.67 JP13.7
ELE7  (via drill 0.5)
  Top 0.254: IC6.15 75.4,27.14 75.4,25.23 arc-90 74.3,24.13
  Top 0.305: v72.39,52.39 70.8,53.98 58.1,53.98 56.83,55.24 53.45,55.24 arc-90 53.1,55.6 | JP13.8 74.3,24.13
  Top 0.61: U$24.1 53.1,55.6
  Bottom 0.305: v72.39,52.39 72.39,51.12 78.26,45.24 78.26,29.69 73.66,25.08
  Bottom 0.406: 73.66,25.08 72.71,24.13 JP13.8
ELE8  (via drill 0.5)
  Top 0.254: IC6.16 76.03,23.49 arc-90 74.14,21.59
  Top 0.305: v73.66,51.75 73.66,52.39 71.44,54.61 61.24,54.61 arc-90 60.3,55.55 60.3,55.58 | JP13.9 74.14,21.59
  Top 0.61: U$22.1 60.3,55.58
  Bottom 0.305: v73.66,51.75 73.66,50.8 78.9,45.56 78.9,27.78 73.66,22.54
  Bottom 0.406: 73.66,22.54 72.71,21.59 JP13.9
ELE9
  Top 0.254: IC6.17 76.44,21.35 arc-90 74.14,19.05
  Top 0.305: JP13.10 74.14,19.05
  Bottom 0.305: 73.66,20 79.53,25.88 79.53,45.88 74.93,50.48 74.93,52.39 72.39,54.93 68.14,54.93 arc-92 67.5,55.6
  Bottom 0.406: 73.66,20 72.71,19.05 JP13.10
  Bottom 0.61: U$18.1 67.5,55.6
ELE10
  Top 0.254: IC6.18 76.83,19.21 arc-90 74.14,16.51
  Top 0.305: JP13.11 74.14,16.51
  Bottom 0.305: 73.66,17.46 80.17,23.97 80.17,46.2 76.2,50.16 76.2,53.98 arc90 75.56,54.61 arc-90 74.7,55.48 74.7,55.59
  Bottom 0.406: 73.66,17.46 72.71,16.51 JP13.11
  Bottom 0.61: U$17.1 74.7,55.59
ELE11
  Top 0.254: IC6.19 77.23,17.07 arc-90 74.14,13.97
  Top 0.305: JP13.12 74.14,13.97
  Bottom 0.305: 73.66,14.92 80.8,22.07 80.8,46.51 77.47,49.85 77.47,53.98 arc-90 78.11,54.61 80.93,54.61 arc90 81.9,55.58
  Bottom 0.406: 73.66,14.92 72.71,13.97 JP13.12
  Bottom 0.61: 81.9,55.58 U$3.1
G1
  Top 0.254: U2.12 U2.11 U2.10 U2.9 51.14,43.52 53.66,46.04 56.67,46.04 57.15,45.56 60.48,45.56 60.98,45.07 R9.1
G2
  Top 0.254: U2.25 48.26,33.11 R10.1
GND  (via drill 0.5)
  Top 0.254: U1.35 50.39,12.61 U1.EXP | 52.89,14.11 U1.EXP | U1.EXP 53.39,15.61 U1.15 53.39,19.41 54.53,20.56 | U1.23 49.89,17.11 U1.EXP | U1.EXP 49.89,12.11 U1.33 48.3,12.11 46.98,10.78 | U2.20 U2.21 U2.22 50,36.67 v50.16,36.91 50.96,37.62 v50.96,39.69 | U2.35 54.64,38.71 v53.66,39.69 53.64,39.71 U2.4 53.64,44.11 53.98,44.45 55.64,44.45 55.96,44.13 56.67,44.13 56.99,43.81 R9.2 | C29.2 69.03,37.35 C31.1 68.26,38.1 68.26,38.26 67.63,38.89 67.63,40.01 | 67.63,40.01 67.63,42.39 C28.2 | RN5.3 38.98,38.02 39.21,37.78 39.21,36.67 41.12,34.77 C18.2 42.21,34.15 42.5,33.86 44.04,33.86 v44.67,34.48 45.41,35.23 C32.1 45.7,35.23 | 50.8,39.67 v50.96,39.69 | U1.EXP 54.39,12.61 U1.43 54.39,10.7 54.93,10.16 57.8,10.16 C9.1 | C11.1 46.98,10.78 | IC6.6 77.64,29.69 78.42,30.48 79.06,30.48 | 79.06,30.48 79.69,31.11 79.69,32.7 79.38,33.02 78.75,33.02 R8.2 | 82.55,29.84 81.92,30.48 79.06,30.48 | 82.55,29.84 82.55,27.62 82.22,27.29 C20.1 81.6,26.35 82.31,25.64 v82.31,22.54 | 82.55,29.84 82.55,40.01 80.96,41.59 80.96,43.5 75.88,48.58 68.91,48.58 C30.1 70.48,47.94 71.75,46.67 71.75,45.09 71.44,44.77 70.82,44.77 C24.1 70.79,44.77 70.17,44.77 69.53,45.4 IC8.2 | R6.2 26.19,38.1 20.18,38.1 20.18,37 C21.1 20.02,37.15 v19.05,37.15 | C22.1 78.74,18.41 79.06,18.1 v79.69,18.1 | 46.98,10.78 39.38,10.78 v38.1,11.75 | C28.2 65.72,42.39 | IC7.2 67.63,40.01 | C25.1 63.5,41.59 v63.5,42.55 | C8.2 49.23,24.43 48.97,24.69 48.97,26.43 49.29,26.75 50.72,26.75 51.12,27.15 55.72,27.15 56.83,26.04 v56.83,25.4 | C33.1 52.4,29.84 | L5.2 59.99,29.83 63.52,33.35 C26.1 63.52,36.5 63.5,36.51 59.69,36.51 59.69,37.45 C35.1 58.72,38.42 v58.42,38.42
  Top 0.254: C34.1 45.7,40.64 | v46.99,31.11 48.12,29.99 R10.2 | v50.96,39.69 50.72,39.61 49.37,39.61 49.31,39.67 U2.16 46.75,39.67 C34.1 | 54.53,20.56 60.56,20.56 61.28,21.27 v61.28,21.59 | 54.53,20.56 55.24,21.27 C7.2 | IC5.8 20.32,29.68 20.32,28.89 v20.16,28.89 | 44.35,42.07 C19.2 44.29,42.07 45.66,40.7 C34.1 | v54.53,32.23 54.53,30.08 54.62,29.99 R15.2 | v65.41,40.32 65.41,41.56 C28.2 | RN6.8 RN6.7 21.82,13.25 | 5.77,16.5 L2.1 v8.57,15.4 8.57,14.29 9.37,13.49 15.08,13.49 15.56,13.02 C17.1 | IC3.4 35.99,13.44 36.51,13.97 C12.1 | RN6.5 23.46,13.02 25.08,13.02 v25.08,13.18 | IC2.2 v12.06,20.64 | R3.2 22.69,20.02 C14.2 v25.4,20.95 | 12.7,5.08 14.61,5.08 15.56,6.03 15.56,7.3 16.51,8.26 16.51,8.89 17.14,9.53 17.14,9.84 | 16.19,10.79 15.88,10.79 IC4.2 | v14.29,11.11 14.61,11.11 14.92,10.79 | 16.51,10.79 16.83,10.48
  Top 0.406: 3.33,23.46 3.79,23.46 X1.S3 | X3.6 5,36.28 | X3.S2 4.24,37.03 5,36.28 | 5,36.28 3.38,34.66 X3.S1 3.33,26.07 3.33,23.46 | J1.7 J1.6 | X1.S4 3.79,16.86 X1.S2 | 3.33,23.46 X1.S1 | ON.C L.C | 21.02,14.92 RN6.8 | 28.47,15.32 28.74,15.58
  Top 0.508: IC1.2 29.82,17.82 29.78,17.78 28.78,17.78 28.75,17.75 | 29.06,14.73 29.55,14.73 | 28.47,17.48 28.75,17.75 | 28.75,17.75 28.75,17.04 28.54,16.83 v28.26,16.83 | 14.92,10.79 15.88,10.79 | X1.S4 6.03,16.24 6.03,15.56
  Top 0.61: X1.S2 X1.S6 X1.S5 X1.S1 | U$6.P$1 6.26,3.4 | S2.4 arc-90 8.4,6.35
  Top 1.016: C1.2 29.26,15.32 28.47,15.32 | 28.99,14.8 28.99,13.88 29.01,13.89 29.96,13.89 29.87,13.98 29.3,13.98
  Bottom 0.254: v53.66,39.69 50.82,39.71 arc90 v50.96,39.69 | v50.16,36.91 50.48,36.83 | v56.83,25.4 56.49,25.41 | v38.1,11.75 38.1,12.7 | v72.39,6.35 72.39,6.67 | v46.99,31.11 46.99,31.43 | v65.41,40.32 65.72,40.32 | v58.42,38.42 58.1,38.73 | 55.4,32.54 55.56,33.02 | v79.69,18.1 79.69,18.41 82.31,21.03 v82.31,22.54 | v25.08,13.18 25.08,13.65 | v8.57,15.4 8.57,14.92 | v12.06,20.64 11.75,20.95 | v25.4,20.95 26.04,20.95 | v14.29,11.11 14.29,12.06
  Bottom 0.406: v28.26,16.83 28.26,17.14
  Bottom 0.61: U$6.P$1 2.7,6.19
  other vias: 18.73,1.75 54.45,28.81
  pour Top (isolate 0.305): 0,0 0,50.8 64.77,50.8 70.33,45.09 70.33,12.38 84.77,12.38 84.77,7.94 76.83,0
  pour Bottom (isolate 0.305): 0,0 77.15,0 84.77,7.62 84.77,20.32 79.69,20.32 79.69,17.78 74.3,12.38 70.33,12.38 70.33,45.09 64.77,50.8 0,50.8
GPIO0
  Top 0.254: U2.33 53.64,31.79 R13.1
GPIO1
  Top 0.254: R15.1 R16.2 56.83,31.43 55.17,33.1 54.37,33.1 54.14,33.33 U2.34
IO8/MP3-RST  (via drill 0.5)
  Top 0.254: U1.28 44.77,14.61 38.1,21.27 v38.1,23.81 | 41.67,49.21 41.66,49.2 41.66,47.94
  Top 0.406: JP3.1 41.67,50.78 41.67,49.21
  Top 0.61: JP6.2 41.66,47.94
  Bottom 0.254: v38.1,23.81 38.1,26.04 35.56,28.57 35.56,42.23 41.66,48.32 41.66,49.2 41.67,49.21
  Bottom 0.406: JP3.1 41.67,50.78 41.67,49.21
IO8/MP3-RST-*  (via drill 0.5)
  Top 0.254: 26.17,33.02 IC5.14 26.12,33.02 25.08,33.02 24.77,33.34 24.77,35.24 25.23,35.7 | 25.23,35.7 R6.1 | 41.59,45.4 40.8,44.61 31.75,44.61 26.51,39.37 23.18,39.37 22.54,40.01 v21.91,40.01 | v23.5,36.83 23.5,35.88 23.67,35.7 25.23,35.7
  Top 0.305: JP6.1 41.59,45.88
  Top 0.61: 41.59,45.88 41.59,45.4
  Bottom 0.254: 21.91,39.05 v21.91,40.01 21.91,38.42 v23.5,36.83
IO9*/MP3-CS  (via drill 0.5)
  Top 0.254: U1.29 44.31,14.11 37.15,21.27 v37.15,22.54 | 39.12,46.58 39.12,47.94 39.12,49.2 39.13,49.21
  Top 0.406: JP3.2 39.13,50.78 39.13,49.21
  Top 0.61: 39.12,47.94 JP5.2
  Bottom 0.254: v37.15,22.54 37.15,26.04 34.92,28.26 34.92,42.39 39.13,46.59 39.13,49.21
  Bottom 0.406: JP3.2 39.13,50.78 39.13,49.21
IO9*/MP3-CS-*  (via drill 0.5)
  Top 0.254: IC5.11 26.12,31.11 23.5,31.11 23.02,31.59 23.02,33.02 22.07,33.97 22.07,36.67 v21.91,36.83 | 39.05,45.4 38.73,45.09 31.43,45.09 26.35,40.01 23.5,40.01 22.54,40.96 21.27,40.96 v20.32,40.01
  Top 0.305: JP5.1 39.05,45.88
  Top 0.61: 39.05,45.88 39.05,45.4
  Bottom 0.254: v20.32,40.01 20.32,38.42 v21.91,36.83
IO10*  (via drill 0.5)
  Top 0.254: U1.30 43.86,13.61 36.2,21.27 v36.2,23.81 | 36.59,49.21 36.58,49.2 36.58,47.93
  Top 0.406: JP3.3 36.59,50.78 36.59,49.21
  Top 0.61: JP4.2 36.58,47.93
  Bottom 0.254: v36.2,23.81 36.2,24.45 33.02,27.62 33.02,46.35 34.92,48.26 36.58,48.26 36.58,49.2 36.59,49.21
  Bottom 0.406: JP3.3 36.59,50.78 36.59,49.21
IO11*  (via drill 0.5)
  Top 0.254: v34.29,22.54 v34.29,25.08 | U1.12 55.42,18.41 v56.67,18.41
  Bottom 0.254: v34.29,25.08 32.38,26.99 32.38,46.67 34.05,48.34 34.05,49.21 | v34.29,22.54 35.88,20.95 40.96,20.95 41.59,20.32 48.26,20.32 50.48,18.1 56.36,18.1 v56.67,18.41
  Bottom 0.406: JP3.4 34.05,50.78 34.05,49.21
IO12  (via drill 0.5)
  Top 0.254: U1.26 46.94,15.61 40.96,21.59 v40.96,22.54
  Bottom 0.254: 31.75,49.2 31.75,26.51 36.67,21.59 40.01,21.59 v40.96,22.54
  Bottom 0.406: JP3.5 31.75,50.55 31.75,49.2
IO13*  (via drill 0.5)
  Top 0.254: U1.32 42.96,12.61 36.04,19.53 | IC3.5 34.95,18.45 34.96,18.45 36.04,19.53 | 36.04,19.53 33.34,22.23 v33.34,23.81
  Bottom 0.254: v33.34,23.81 31.11,26.04 31.11,46.67 28.96,48.83 28.96,49.2
  Bottom 0.406: 28.96,49.2 JP3.6
LEFT  (via drill 0.5)
  Top 0.254: 58.42,41.27 R17.1 | v56.36,42.07 56.99,42.07 57.78,41.27 58.42,41.27 | v48.1,42.07 46.51,43.66 34.77,43.66 v34.45,43.34 | v34.92,46.99 29.84,46.99 26.99,44.13 19.05,44.13 18.26,43.34 PC2.+ | U2.46 57.31,40.17 58.42,41.27
  Bottom 0.254: v34.45,43.34 34.92,43.81 v34.92,46.99 | v48.1,42.07 48.26,42.23 56.2,42.23 v56.36,42.07
MIDI-RX  (via drill 0.5)
  Top 0.254: RN5.1 RN5.2 38.18,38.82 37.78,38.42 37.78,36.51 41.27,33.02 43.5,33.02 43.81,33.34 45.4,33.34 v45.72,33.66 | U2.26 50.14,33.31 49.53,32.7 v49.53,32.38 R12.2
  Bottom 0.254: v45.72,33.66 48.26,33.66 v49.53,32.38
MISO  (via drill 0.5)
  Top 0.254: v63.82,21.59 63.82,20 62.87,19.05 58.74,19.05 56.79,17.11 U1.11 | v23.81,27.94 24.45,27.94 25.56,29.05 27.78,29.05 29.84,31.11 45.72,31.11 47.31,32.7 47.31,34.61 47.78,35.08 49.05,35.08 49.21,35.24 51.91,35.24 52.14,35.02 U2.30 52.14,32.61 51.44,31.91 51.44,28.89 52.39,27.94 60.01,27.94 62.55,30.48 ICSP.1 | X3.7 9.93,37.38 v10.16,37.15
  Bottom 0.254: ICSP.1 62.55,30.48 61.59,29.53 61.59,23.81 v63.82,21.59 | v23.81,27.94 14.29,27.94 8.89,33.34 8.89,35.88 v10.16,37.15
MOSI  (via drill 0.5)
  Top 0.254: ICSP.4 64.77,26.67 64.77,20 62.87,18.1 v59.69,18.1 58.58,18.1 57.09,16.61 U1.10 | IC5.5 21.28,31.74 21.59,31.43 21.59,27.15 23.02,25.72 29.21,25.72 31.43,27.94 44.77,27.94 48.58,24.13 48.58,22.54 v49.21,21.91
  Bottom 0.254: v59.69,18.1 58.1,19.68 56.52,19.68 55.56,18.73 50.8,18.73 49.21,20.32 v49.21,21.91
MOSI_L  (via drill 0.5)
  Top 0.254: IC5.4 19.04,32.39 18.1,33.34 11.75,33.34 11.39,32.98 X3.3 5.67,32.98 5.08,32.38 5.08,29.84 7.94,26.99 19.53,26.99 v19.68,27.15 | v25.72,26.99 25.72,27.3 26.19,27.78 28.42,27.78 30.48,29.84 46.2,29.84 48.74,27.3 50.48,27.3 50.96,27.78 50.96,32.23 51.64,32.91 U2.29
  Bottom 0.254: v25.72,26.99 19.84,26.99 v19.68,27.15
MP3-CS_L
  Top 0.254: IC5.12 27.3,31.74 27.62,32.07 29.21,32.07 29.53,31.75 45.4,31.75 46.67,33.02 46.67,35.56 47.28,36.17 U2.23
MP3-DCS_L  (via drill 0.5)
  Top 0.254: U2.13 47.57,41.17 46.83,41.91 46.83,42.39 46.04,43.18 41.59,43.18 40.96,42.55 31.27,42.55 27.94,39.21 27.94,38.1 v28.57,37.47 | IC5.10 26.18,30.48 27.3,30.48 v27.94,31.11
  Bottom 0.254: v28.57,37.47 28.57,31.75 v27.94,31.11
MP3-RST_L  (via drill 0.5)
  Top 0.254: U2.3 54.14,43.66 54.29,43.81 55.48,43.81 55.8,43.5 56.52,43.5 57.47,42.55 61.91,42.55 62.23,42.86 R14.2 62.22,44.12 63.5,45.4 v64.29,45.4 | 26.18,33.66 IC5.15 28.54,33.69 29.84,32.38 44.29,32.38 v44.45,32.54
  Bottom 0.254: v44.45,32.54 44.45,28.57 46.04,26.99 47.31,26.99 47.94,27.62 51.12,27.62 53.98,30.48 56.83,30.48 61.59,35.24 64.45,35.24 66.67,37.47 66.67,42.86 v64.29,45.4
N$1  (via drill 0.5)
  Top 0.254: IC3.6 IC3.7 33.65,18.74 v33.33,19.06 | RN3.3 21.82,10.95 24.29,10.95 24.77,11.43 v24.77,11.75
  Bottom 0.254: v24.77,11.75 27.3,11.75 29.53,13.97 29.53,19.05 30.96,20.48 31.91,20.48 v33.33,19.06
N$2
  Top 0.254: L.A 20,6.35 21.82,8.17 RN3.6
N$3
  Top 0.254: 22.54,8.77 RN3.7 22.62,3.99 TX.A
N$4
  Top 0.406: RN2.7 RN2.8 13.22,12.7 14.61,12.7 15.53,11.78 IC4.1
N$5
  Top 0.254: C23.1 58.1,39.37 57.9,39.17 U2.44
N$6
  Top 0.254: RN3.8 24.17,8.85 25.08,7.94 RX.A
N$8
  Top 0.254: ON.A 17.46,4.76 21.02,8.32 RN3.5
N$9
  Top 0.254: C18.1 44.01,35.27 Q4.3 45.21,37.77 R7.1 46.02,37.77 46.92,38.67 U2.18
N$10
  Top 0.254: C19.1 41.71,41.57 Q4.1 41.71,39.88 42.86,38.73 44.77,38.73 45.1,39.07 R7.2 45.82,39.17 U2.17
N$11
  Top 0.508: L1.1 29.68,9.55 30.68,9.55 30.91,9.78 30.91,11.46 31.32,11.86 | 31.32,11.86 31.14,12.04 30.48,12.04 30.53,11.99 30.53,9.78 30.76,10.01 30.76,11.79 | 31.32,11.86 31.43,11.98 31.43,15.72 30.32,16.83 IC1.1
N$12
  Top 0.406: R3.1 R2.1
  Top 0.508: IC1.4 24.31,18.73 R3.1
N$13  (via drill 0.5)
  Top 0.254: 6.99,11.75 7.14,11.75 X2.2 7.19,11.75 v3.17,11.75
  Top 0.406: F2.1 9.81,11.79 X2.2
N$14  (via drill 0.5)
  Top 0.254: 34.16,45.91 v33.97,46.04 | v33.97,40.64 34.29,40.32 39.69,40.32 39.89,40.12 RN5.8
  Top 0.61: JP4.1 34.1,45.91 arc-90 v33.97,46.04
  Bottom 0.254: v33.97,46.04 33.66,45.72 33.66,40.96 v33.97,40.64
N$15
  Top 0.254: IC3.2 IC3.1
N$19
  Top 0.254: RN6.2 RN6.1 20.98,11.75 20.98,11.74
  Top 0.508: IC4.5 20.99,11.74 arc-90 RN6.1
N$21
  Top 0.254: R17.2 C25.2
N$22
  Top 0.254: C26.2 R18.2
N$23  (via drill 0.5)
  Top 0.254: S2.5 11.43,5.08 12.06,4.45 14.92,4.45 18.26,7.78 v18.26,8.18
  Top 0.508: IC1.3 30.8,18.73 v31.43,18.1
  Bottom 0.254: 31.75,15.24 31.75,11.11 29.84,9.21 19.21,9.21 v18.26,8.18
  Bottom 0.508: v31.43,18.1 31.75,17.78 31.75,15.24
N$24  (via drill 0.5)
  Top 0.254: PC2.- 16.26,48.93 16.26,49.47
  Top 0.305: v8.89,42.55 10.72,42.55 X4.2
  Top 0.406: 16.26,49.47 JP11.3
  Bottom 0.305: 16.26,49.59 14.61,47.94 9.21,47.94 8.26,46.99 8.26,43.18 v8.89,42.55
  Bottom 0.406: 16.26,49.59 JP11.3
N$25
  Top 0.254: 63.37,32.25 59.69,28.57 57.15,28.57 56.83,28.89 R16.1
  Top 0.305: 63.82,32.7 63.37,32.25
  Top 0.508: JP10.1 64,32.89 63.82,32.7
N$26
  Top 0.254: 13.72,51.82 14.61,52.7 19.37,52.7 20.08,51.99 20.08,46.59 20.88,45.8 24.11,45.8 PC1.-
  Top 0.305: X4.3 5.07,48.26 5.4,48.26 9.84,52.7 12.7,52.7 13.49,51.91 13.59,51.82 13.72,51.82
  Top 0.406: JP11.2 13.72,51.69 13.49,51.91
N$27
  Top 0.254: RN5.7 RN5.6
N$32
  Top 0.406: RN2.2 RN2.1 13.54,14.61 CHG.C
N$73
  Top 0.254: U2.36 56,34.17 58.26,31.91 R11.1
RD+  (via drill 0.5)
  Top 0.254: U1.4 58.31,13.61 60.48,11.43 v61.59,11.43 | R5.2 13.02,16.35 v12.06,15.4
  Bottom 0.254: v61.59,11.43 61.59,8.26 59.05,5.71 34.92,5.71 34.29,5.08 26.99,5.08 26.35,4.45 15.24,4.45 11.11,8.57 11.11,14.45 v12.06,15.4
RD-  (via drill 0.5)
  Top 0.254: U1.3 58.02,13.11 62.23,8.89 v62.87,8.89 | R4.2 11.11,16.35 v10.16,15.4
  Bottom 0.254: v62.87,8.89 62.87,8.57 59.37,5.08 35.56,5.08 34.92,4.45 27.3,4.45 26.67,3.81 14.92,3.81 10.16,8.57 v10.16,15.4
RESET  (via drill 0.5)
  Top 0.254: S1.3 68.9,5.08 R1.2 | S1.3 S1.4 v69.22,1.59 | ICSP.5 62.71,24.61 62.71,20 62.23,19.53 55.4,19.53 54.39,18.51 U1.13 | v68.5,25.4 68.5,8.65 S1.3
  Bottom 0.254: v68.5,25.4 68.5,27.7 66.99,29.21 62.87,29.21 62.23,28.57 62.23,26.67 ICSP.5 | 33.34,0.95 33.66,0.64 68.26,0.64 v69.22,1.59
  Bottom 0.406: 33.34,0.95 33.02,1.27 J1.3
REXT
  Top 0.254: IC6.7 77.23,30.23 R8.1
RIGHT  (via drill 0.5)
  Top 0.254: v26.99,26.99 28.57,26.99 30.8,29.21 45.56,29.21 v46.99,27.78 | U2.39 57.63,36.67 58.74,35.56 R18.1 | PC1.+ 26.21,43.18 v26.99,43.18 | 59.67,35.53 R18.1 | v59.37,34.29 59.37,35.26 R18.1
  Bottom 0.254: v26.99,26.99 26.99,27.62 26.04,28.57 26.04,42.23 v26.99,43.18 | 47.15,27.94 v46.99,27.78 47.31,28.1 50.64,28.1 53.66,31.11 56.2,31.11 v59.37,34.29
RXLED  (via drill 0.5)
  Top 0.254: RX.C 25.3,1.81 26.35,2.86 v26.35,6.99 | U1.8 58.47,15.61 v59.05,16.19
  Bottom 0.254: v26.35,6.99 58.42,6.99 59.69,8.26 59.69,15.56 v59.05,16.19
SCK  (via drill 0.5)
  Top 0.254: v65.72,21.59 65.72,20 62.87,17.14 58.42,17.14 57.38,16.11 U1.9 | IC5.3 21.41,33.04 22.07,32.38 22.07,27.46 23.34,26.19 28.73,26.19 31.11,28.57 45.09,28.57 47.94,25.72 v48.1,25.72
  Bottom 0.254: ICSP.3 64.77,26.67 64.77,22.54 v65.72,21.59 65.72,21.27 65.09,20.64 63.5,20.64 57.47,26.67 49.05,26.67 v48.1,25.72
SCK_L
  Top 0.254: X3.5 17.53,35.18 19.01,33.69 IC5.2 21.55,33.69 22.54,32.7 22.54,27.78 23.18,27.15 24.61,27.15 25.88,28.42 28.1,28.42 30.16,30.48 46.35,30.48 49.05,27.78 50.16,27.78 50.48,28.1 50.48,32.7 51.14,33.36 U2.28
SD-CS_L
  Top 0.254: X3.2 11.3,31.88 12.7,30.48 18.41,30.48 19.03,31.09 IC5.6
TXLED  (via drill 0.5)
  Top 0.254: TX.C 22.76,1.81 23.81,2.86 v23.81,6.99 | U1.22 49.83,17.94 v48.42,17.94
  Bottom 0.254: v48.42,17.94 47.31,19.05 44.77,19.05 42.23,16.51 42.23,12.7 37.15,7.62 27.62,7.62 27.3,7.94 24.13,7.94 23.81,7.62 v23.81,6.99
UCAP
  Top 0.254: C10.2 59.37,14.13 58.9,14.61 U1.6
UGND  (via drill 0.5)
  Top 0.254: 60.64,13.18 59.53,13.18 58.6,14.11 U1.5 | 60.64,13.18 61.28,13.18 61.61,13.51 C10.1 | v60.64,12.7 60.64,13.18 | 8.56,17.8 L2.2 | L2.2 8.56,17.78 | L2.2 v8.57,18.89 4.65,18.89 X1.P5
  Bottom 0.254: v60.64,12.7 60.64,8.26 58.74,6.35 34.61,6.35 33.97,5.71 26.67,5.71 26.04,5.08 15.56,5.08 11.75,8.89 11.75,13.34 13.34,14.92 13.34,15.56 12.06,16.83 9.54,16.83 L2.2 v8.57,18.89
V_BATT  (via drill 0.5)
  Top 0.406: T1.1 32.96,9.46 v32.97,9.42 | v13.02,9.21 13.02,9.84 | 13.02,9.84 13.02,10.65 F2.2 13.17,10.8 | IC4.3 15.53,9.84 13.02,9.84
  Bottom 0.406: v13.02,9.21 13.02,8.57 15.88,5.71 18.1,5.71 20.95,8.57 32.12,8.57 v32.97,9.42
VCC  (via drill 0.5)
  Top 0.406: IC1.6 26.86,16.63 26.86,15.42 | 26.86,15.42 C1.1 26.83,14.9 | 30.48,8.26 31.75,9.53 31.75,11.11 32.38,11.75 34.98,11.75 T1.2 | v19.05,19.21 19.05,17.22 D2.C | S2.6 13.93,6.95 v15.56,8.57 | C2.1 26.14,16.92 26.16,14.25 26.16,14.22 25.81,14.22 | 24.28,14.22 25.81,14.22 | 25.81,14.22 25.81,14.61 | 25.81,16.41 25.81,14.61 | 25.81,14.61 24.38,14.61 24.38,14.96 25.58,14.96 25.58,15.29 | 25.58,15.29 24.71,15.29 | 24.41,15.29 24.71,15.29 | 24.71,15.29 25.55,16.13 25.55,15.67 25.3,15.42 | 26.86,15.42 25.7,15.42 25.58,15.29
  Top 0.508: 26.83,9.79 L1.2 26.83,9.68 28.26,8.26 30.48,8.26 | D2.C 21.09,17.46 C2.1
  Top 1.27: L1.2 26.86,10.82 C1.1
  Bottom 0.406: v19.05,19.21 19.05,13.34 15.56,9.84 v15.56,8.57
VREG
  Top 0.254: IC6.5 81.45,28.74 C20.2
VUSB  (via drill 0.5)
  Top 0.254: U1.7 60.31,15.11 C4.2 60.31,16.02 60.64,16.35 63.66,16.35 v63.82,16.19 | v39.85,8.73 v38.26,10.32 | C17.2 19.37,13.02 20,12.38 23.18,12.38 23.43,12.13 RN6.4
  Top 0.406: F1.2 14.92,23.5 | 14.92,23.5 JP1.2 C3.1 20.95,23.62 20.95,24.45 21.59,25.08 24.77,25.08 25.4,24.45 v25.4,24.13 | T1.3 37.74,9.8 v38.26,10.32 | CHG.A 18.2,13.42 C17.2 17.8,12.71 17.14,12.06 17.14,11.11 18.41,9.85 IC4.4 | 14.92,23.5 14.92,17.46 D2.A
  Top 0.508: CHG.A 18.1,14.7 18.1,15.24 15.88,17.46 D2.A
  Bottom 0.254: v63.82,16.19 63.5,16.51 60.01,16.51 59.37,17.14 58.42,17.14 57.78,16.51 57.78,14.61 59.05,13.34 59.05,8.57 58.1,7.62 40.96,7.62 v39.85,8.73
  Bottom 0.406: v38.26,10.32 39.69,11.75 39.69,15.88 35.88,19.68 35.24,19.68 33.97,20.95 33.66,20.95 31.75,22.86 31.75,23.5 31.11,24.13 v25.4,24.13
XTAL1
  Top 0.254: U1.17 52.39,23.88 Q1.1 50.85,25.73 C8.1
XTAL2
  Top 0.254: U1.16 52.89,20.68 Q1.3 53.61,21.26 55.07,22.72 C7.1
XUSB
  Top 0.305: X1.P1 5.61,21.48
  Top 0.406: 5.61,21.48 6.24,21.48 8.26,23.5 F1.1 12.06,22.39 IC2.5
(copper drawn outside any net)
  shapes: Top area x2

## Text on the board
tNames: F1 | + | - | F2
Document: FUSE2 | U$22 | J5 | + | - | U$1 | FUSE | U$3 | + | + | + | + | U$24 | - | - | - | -